# Altium project PCB_Project.PrjPcb
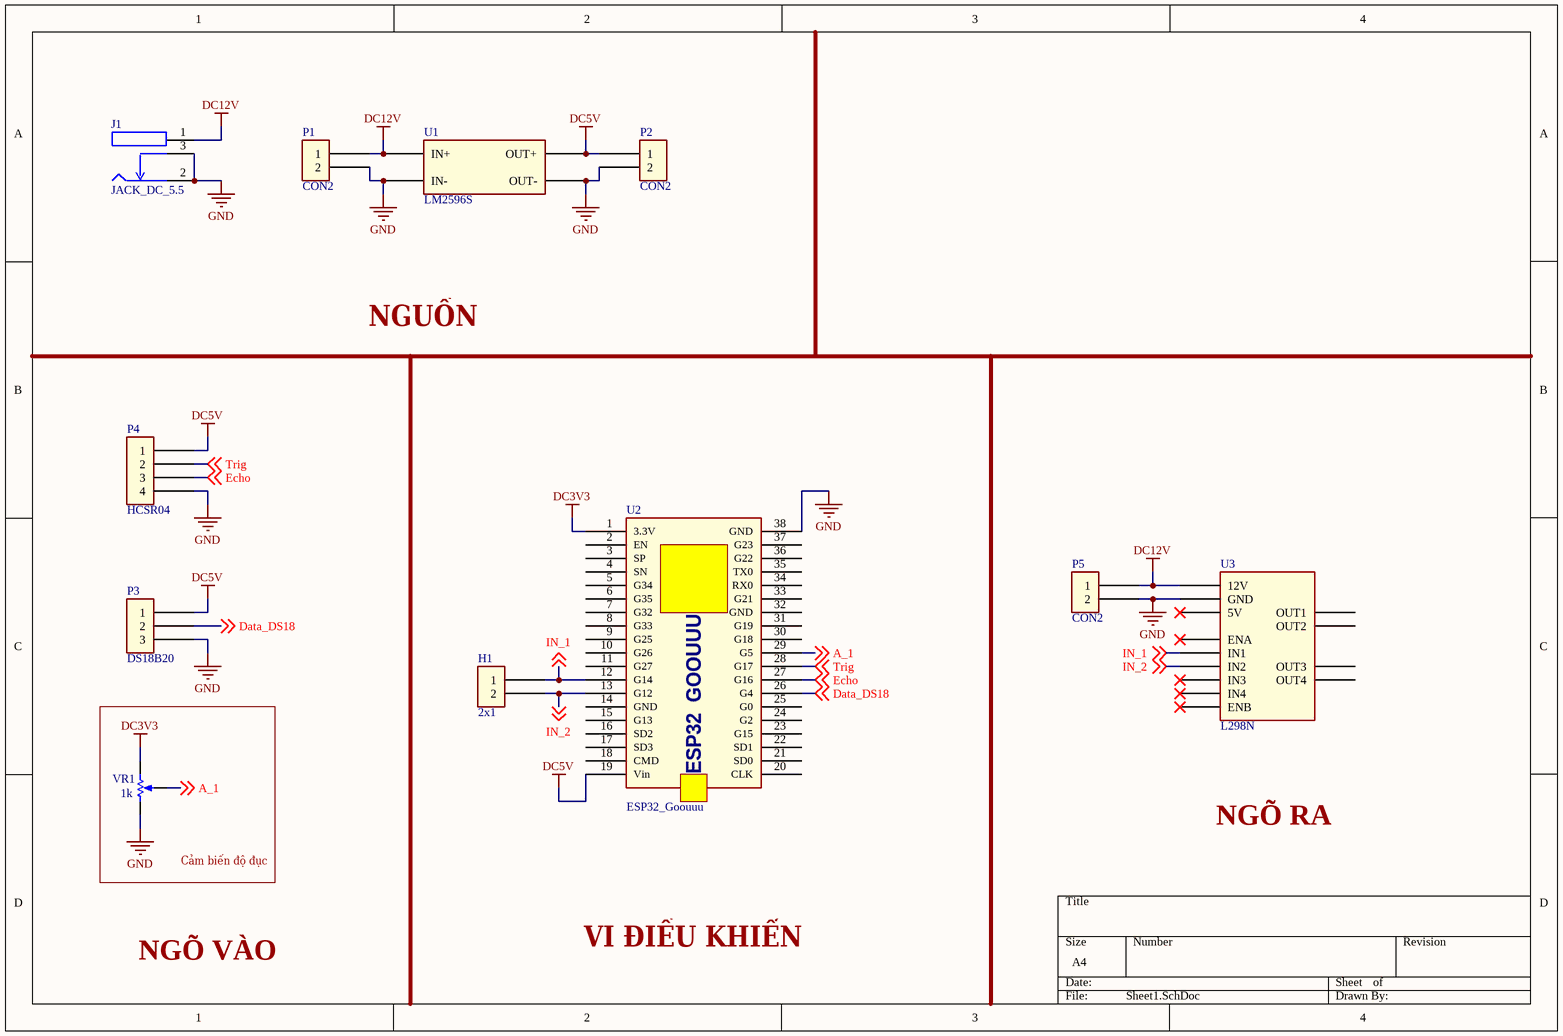
[diagram p0: Sheet1.SchDoc]
1 sheet, 11 parts. Net scope: global (net labels, ports and power ports of the same name join across sheets).
Board file: PCB1.PcbDoc

## Sheet Sheet1.SchDoc
size A4; SheetNumber: 1; SheetTotal: 1

### Parts
H1  2x1  [HED_2X1_1]
J1  JACK_DC_5.5  [DC5.5/2.1]
P1  CON2  [CON2]
P2  CON2  [CON2]
P3  DS18B20  [CON3]
P4  HCSR04  [CON4]
P5  CON2  [CON2]
U1  LM2596S  [LM2596S]
U2  ESP32_Goouuu  [ESP32_Goouuu]
U3  L298N  [L298N]
VR1  1k  [VR_VOLUME]

### Blocks framed on the sheet
Cảm biến độ đục: VR1

### Nets
DC3V3: U2.1(3.3V) VR1.1(CCW)
DC5V: P2.1 P3.1 P4.1 U1.1(OUT+) U2.19(Vin)
DC12V: J1.1 P1.1 P5.1 U1.1(IN+) U3.1(12V)
GND: J1.2 J1.3 P1.2 P2.2 P3.3 P4.4 P5.2 U1.1(IN-) U2.38(GND) U3.1(GND) VR1.3(CW)
A_1: U2.29(G5) VR1.2(WIPER) ; off-sheet A_1
Data_DS18: P3.2 U2.26(G4) ; off-sheet Data_DS18
Echo: P4.3 U2.27(G16) ; off-sheet Echo
IN_1: H1.1 U2.12(G14) U3.1(ENA) ; off-sheet IN_1
IN_2: H1.2 U2.13(G12) U3.1(IN2) ; off-sheet IN_2
Trig: P4.2 U2.28(G17) ; off-sheet Trig

Not connected (* = marked no-connect by the designer): U2 2(EN) 3(SP) 4(SN) 5(G34) 6(G35) 7(G32) 8(G33) 9(G25) 10(G26) 11(G27) 14(GND) 15(G13) 16(SD2) 17(SD3) 18(CMD) 20(CLK) 21(SD0) 22(SD1) 23(G15) 24(G2) 25(G0) 30(G18) 31(G19) 32(GND) 33(G21) 34(RX0) 35(TX0) 36(G22) 37(G23)

### Notes on the sheet
- NGUỒN
- NGÕ RA
- NGÕ VÀO
- VI ĐIỀU KHIỂN
- (in symbol ESP32_Goouuu) ESP32  GOOUUU

### Library data of the parts
H1 = HEADER_2X1: Header 2x1
J1 = JACK_DC_5.5: Jack DC 5.5x2.1
P1 P2 P5 = CON2: Connector 2
P3 = CON3: Connector 3
P4 = CON4: Connector 4
VR1 = VR_Volume 1K: Variable_Resistor Volume 1K